# EAGLE schematic schematic1 (EAGLE 7.0.0)
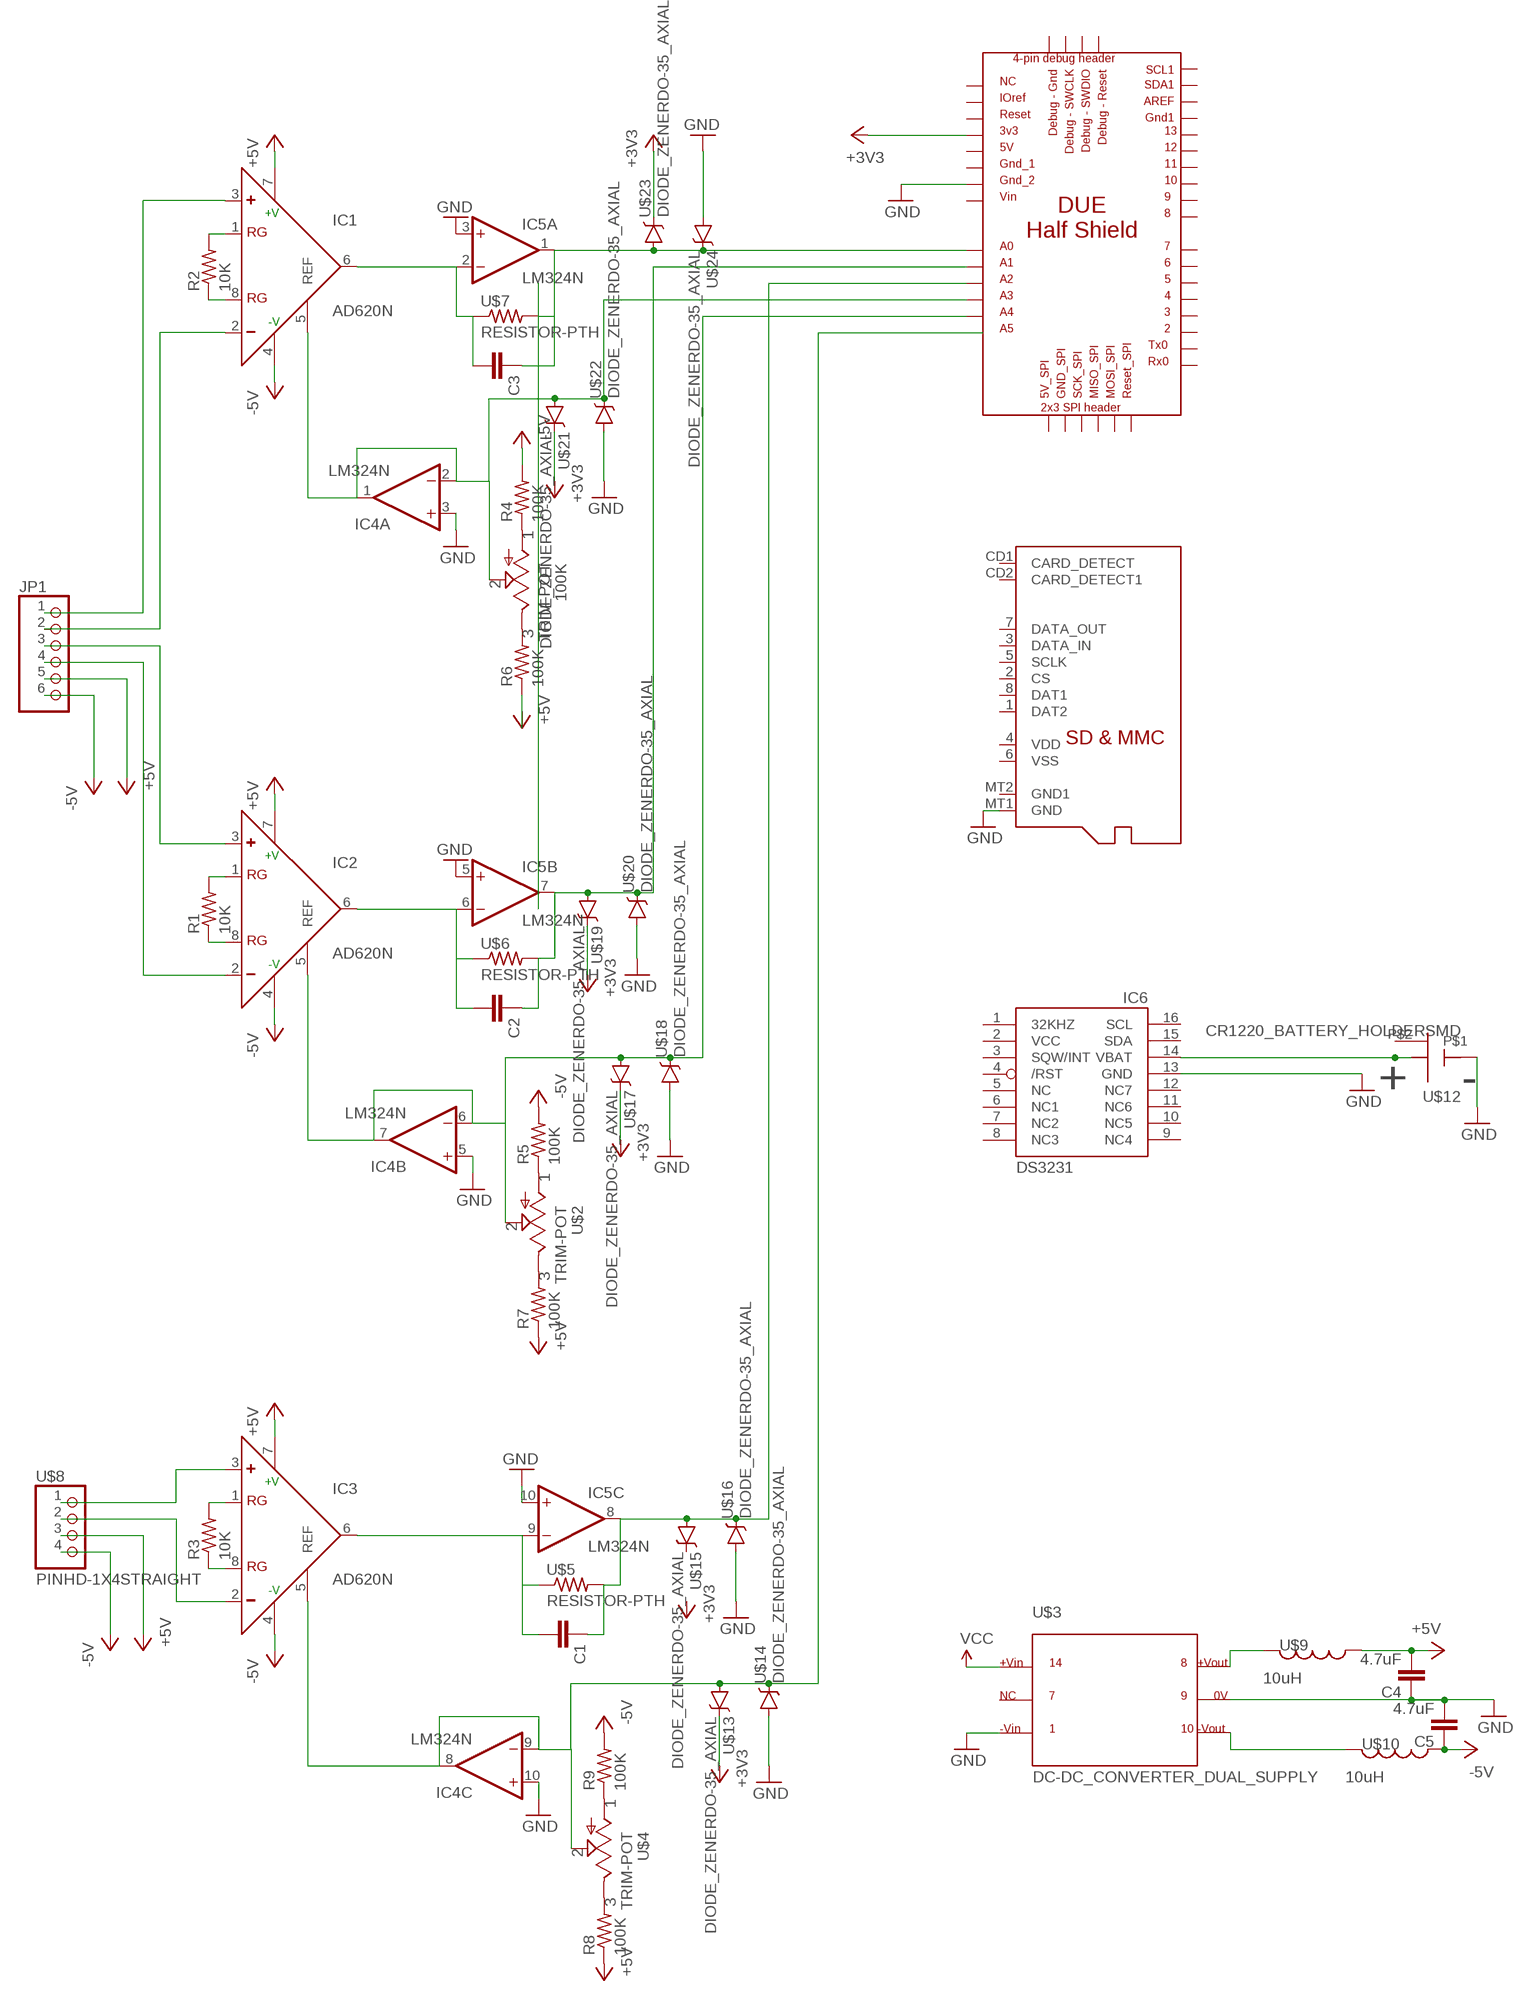
[diagram p0: schematic, sheet 1]

## Parts
100K  TRIM-POT  [R-TRIMMER-BOURNS-3386P]
C1  CAP0805  [0805]
C2  CAP0805  [0805]
C3  CAP0805  [0805]
C4  4.7uF  CAP0805  [0805]
C5  4.7uF  CAP0805  [0805]
IC1  AD620N  [DIL08]
IC2  AD620N  [DIL08]
IC3  AD620N  [DIL08]
IC4  LM324N  [DIL14]
IC5  LM324N  [DIL14]
IC6  DS3231/SO  [SO16W]
JP1  PINHD-1X6  [1X06]
R1  10K  RESISTOR_SMDR0805  [R0805]
R2  10K  RESISTOR_SMDR0805  [R0805]
R3  10K  RESISTOR_SMDR0805  [R0805]
R4  100K  RESISTOR_SMDR0805  [R0805]
R5  100K  RESISTOR_SMDR0805  [R0805]
R6  100K  RESISTOR_SMDR0805  [R0805]
R7  100K  RESISTOR_SMDR0805  [R0805]
R8  100K  RESISTOR_SMDR0805  [R0805]
R9  100K  RESISTOR_SMDR0805  [R0805]
U$1  DUE_HALF_SHIELD  [DUE_HALF_SHIELD]
U$2  TRIM-POT  [R-TRIMMER-BOURNS-3386P]
U$3  DC-DC_CONVERTER_DUAL_SUPPLY  [DCDC_CONVERTOR-MEV1D]
U$4  TRIM-POT  [R-TRIMMER-BOURNS-3386P]
U$5  RESISTOR-PTH  [0309/10]
U$6  RESISTOR-PTH  [0309/10]
U$7  RESISTOR-PTH  [0309/10]
U$8  PINHD-1X4STRAIGHT  [1X04]
U$9  10uH  INDUCTOR0805_TY  [I_0805]
U$10  10uH  INDUCTOR0805_TY  [I_0805]
U$11  MICROSD  [MICROSD]
U$12  CR1220_BATTERY_HOLDERSMD  [CR1220_BATTERY_HOLDER_SMD]
U$13  DIODE_ZENERDO-35_AXIAL  [DO35-7]
U$14  DIODE_ZENERDO-35_AXIAL  [DO35-7]
U$15  DIODE_ZENERDO-35_AXIAL  [DO35-7]
U$16  DIODE_ZENERDO-35_AXIAL  [DO35-7]
U$17  DIODE_ZENERDO-35_AXIAL  [DO35-7]
U$18  DIODE_ZENERDO-35_AXIAL  [DO35-7]
U$19  DIODE_ZENERDO-35_AXIAL  [DO35-7]
U$20  DIODE_ZENERDO-35_AXIAL  [DO35-7]
U$21  DIODE_ZENERDO-35_AXIAL  [DO35-7]
U$22  DIODE_ZENERDO-35_AXIAL  [DO35-7]
U$23  DIODE_ZENERDO-35_AXIAL  [DO35-7]
U$24  DIODE_ZENERDO-35_AXIAL  [DO35-7]

## Nets
+3V3: U$1.3V3 U$13.C U$17.C U$19.C U$21.C U$23.C
+5V: C4.2 IC1.7(+V) IC2.7(+V) IC3.7(+V) R6.1 R7.1 R8.1 U$8.3 U$9.P$1
-5V: C5.1 IC1.4(-V) IC2.4(-V) IC3.4(-V) R4.2 R5.2 R9.2 U$8.4 U$10.P$1
GND: C4.1 C5.2 IC4.3(A:+IN) IC4.5(B:+IN) IC4.10(C:+IN) IC5.3(A:+IN) IC5.5(B:+IN) IC5.10(C:+IN) IC6.13(GND) U$1.GND_2 U$3.P$1_-VIN U$3.P$9_0V U$11.MT1(GND) U$12.GND U$14.A U$16.A U$18.A U$20.A U$22.A U$24.A
N$1: IC2.5(REF) IC4.6(B:-IN) IC4.7(B:OUT) U$1.A4 U$2.P$2-WIPER U$17.A U$18.C
N$2: IC2.1(RG) R1.2
N$3: IC3.5(REF) IC4.8(C:OUT) IC4.9(C:-IN) U$4.P$2-WIPER U$13.A U$14.C
N$4: 100K.P$2-WIPER IC1.5(REF) IC4.1(A:OUT) IC4.2(A:-IN) U$1.A3 U$21.A U$22.C
N$5: IC1.1(RG) R2.2
N$6: IC1.8(RG) R2.1
N$7: IC2.8(RG) R1.1
N$8: R5.1 U$2.P$1
N$9: IC3.1(RG) R3.2
N$10: IC3.8(RG) R3.1
N$11: C3.2 IC1.6(OUT) IC5.2(A:-IN) U$7.1
N$12: 100K.P$3 R6.2
N$13: IC5.1(A:OUT) U$1.A0 U$7.2 U$23.A U$24.C
N$14: R7.2 U$2.P$3
N$15: R8.2 U$4.P$3
N$16: C3.1
N$17: 100K.P$1 R4.1
N$18: IC1.3(+)
N$19: IC1.2(-)
N$20: R9.1 U$4.P$1
N$21: C2.2 IC2.6(OUT) IC5.6(B:-IN) U$6.1
N$22: C2.1 IC5.7(B:OUT) U$1.A1 U$6.2 U$19.A U$20.C
N$23: IC2.3(+)
N$24: IC2.2(-)
N$25: C1.2 IC3.6(OUT) IC5.9(C:-IN) U$5.1
N$26: IC6.14(VBAT) U$12.P$1(VBAT)
N$27: C1.1 IC5.8(C:OUT) U$1.A2 U$5.2 U$15.A U$16.C
N$28: U$3.P$10_-VOUT U$10.P$2
N$29: U$3.P$8_VOUT U$9.P$2
N$31: IC3.2(-) U$8.2
N$32: IC3.3(+) U$8.1
VCC: U$3.P$14_VIN
Unconnected: IC4.12(D:+IN) IC4.13(D:-IN) IC4.14(D:OUT) IC5.12(D:+IN) IC5.13(D:-IN) IC5.14(D:OUT) IC6.1(32KHZ) IC6.3(SQW/INT) IC6.4(/RST) IC6.5(NC) IC6.6(NC1) IC6.7(NC2) IC6.8(NC3) IC6.9(NC4) IC6.10(NC5) IC6.11(NC6) IC6.12(NC7) IC6.15(SDA) IC6.16(SCL) JP1.1 JP1.2 JP1.3 JP1.4 JP1.5 JP1.6 U$1.2 U$1.3 U$1.4 U$1.5 U$1.5V1(5V) U$1.5V_SPI U$1.6 U$1.7 U$1.8 U$1.9 U$1.10 U$1.11 U$1.12 U$1.13 U$1.A5 U$1.AREF U$1.GND1 U$1.GND_1 U$1.GND_DEBUG U$1.GND_SPI U$1.IOREF1(IOREF) U$1.MISO_SPI U$1.MOSI_SPI U$1.NC1(NC) U$1.RESET U$1.RESET_DEBUG U$1.RESET_SPI U$1.RX0 U$1.SCK_SPI U$1.SCL1 U$1.SDA1 U$1.SWCLK_DEBUG U$1.SWDIO_DEBUG U$1.TX0 U$1.VIN1(VIN) U$3.P$7_NC U$11.1(DAT2) U$11.2(CS) U$11.3(DATA_IN) U$11.4(VDD) U$11.5(SCLK) U$11.6(VSS) U$11.7(DATA_OUT) U$11.8(DAT1) U$11.CD1(CARD_DETECT) U$11.CD2(CARD_DETECT1) U$11.MT2(GND1) U$12.P$2 U$15.C

## Power pins joined to a net without a drawn wire
V+: IC4.4(P:V+) IC5.4(P:V+)
V-: IC4.11(P:V-) IC5.11(P:V-)
VCC: IC6.2(VCC)

## Library data of the parts
100K U$2 U$4 = Felicia_force_logger:TRIM-POT: Trimmer potentiometer Example: Digikey PN 3386P-104LF-ND
C1-C5 = Felicia_force_logger:CAP: Capacitor Standard ceramic capacitor, surface mount or 0.1" leaded capacitor.
IC1-IC3 = Felicia_force_logger:AD620: Low Cost, Low Power, Instrumentation Amplifier Source: http://www.analog.com/UploadedFiles/Data_Sheets/37793330023930AD620_e.pdf Digikey PN AD620ANZ-ND or similar 8-DIP Digikey PN AD620ARZ-ND 8-SOIC surface mount; MF: ALTERA CORPORATION; MPN: AD620AN; OC_FARNELL: 1523782; OC_NEWARK: 05F7108
IC4 IC5 = Felicia_force_logger:LM324: OP AMP LM324 quad op amp Digikey PN 296-1391-5-ND 14-PDIP
IC6 = Felicia_force_logger:DS3231: DS3231 Real Time Clock, I2C. Temperature-compensated crystal oscillator 16SOIC-WIDE Digikey PN DS3231SN#T&RCT-ND
JP1 = Felicia_force_logger:PINHD-1X6: PIN HEADER
R1-R9 = Felicia_force_logger:RESISTOR_SMD: RESISTOR, American symbol
U$1 = Felicia_force_logger:DUE_HALF_SHIELD: Arduino Due half shield This shield occupies the normal Uno R3 pins and footprint, along with the Due's 2x3 SPI header and 4-pin debug header. **NOTE** The 5V pin (5V_SPI) on the Due SPI header does supply 5V from the Due, not the 3v3 you might expect.
U$3 = Felicia_force_logger:DC-DC_CONVERTER_DUAL_SUPPLY: Murata DC-DC converter dual-supply Example: Murata PN: MEV1D1205 Digikey PN: 811-2272-ND
U$5-U$7 = Felicia_force_logger:RESISTOR-PTH: Through-hole resistor
U$8 = Felicia_force_logger:PINHD-1X4: 1x4 0.1" space header Holes are slightly staggered to help hold pins in place when soldering.
U$9 U$10 = Felicia_force_logger:INDUCTOR: Inductor Example: Taiyo Yuden PN LBR2012T100K
U$11 = Felicia_force_logger:MICROSD: Micro-SD / Transflash card holder with SPI pinout For the 3M # 2908-05WB-MG and/or 4UCON #19656 push-push type Digikey PN 3M5607CT-ND
U$12 = Felicia_force_logger:CR1220_BATTERY_HOLDER: CR1220 Battery Holder Keystone Part # 3001 Digikey 3001K-ND
U$13-U$24 = Felicia_force_logger:DIODE_ZENER: Zener Diode Example: NXP Semiconductors PN NZX3V6C,133 Digikey PN 568-7963-1-ND